# Altium schematic sheet Power_Stage.SchDoc: Power Stage
size A3; Author: M.Beldyga; CompanyName: WUT ISE; DrawnBy: M.Beldyga; Organization: WUT ISE; Address1: PW ISE; Address2: Nowowiejska 15/19 00-665 Warsaw; Address3: micbeldyga@gmail.com; SheetNumber: 6; SheetTotal: 9; ModifiedBy: -; CheckedDate: -; DivGrp: WUT ISE; Designer: GK, MB; ModifiedDate: -; ProjectName: Sensor Box
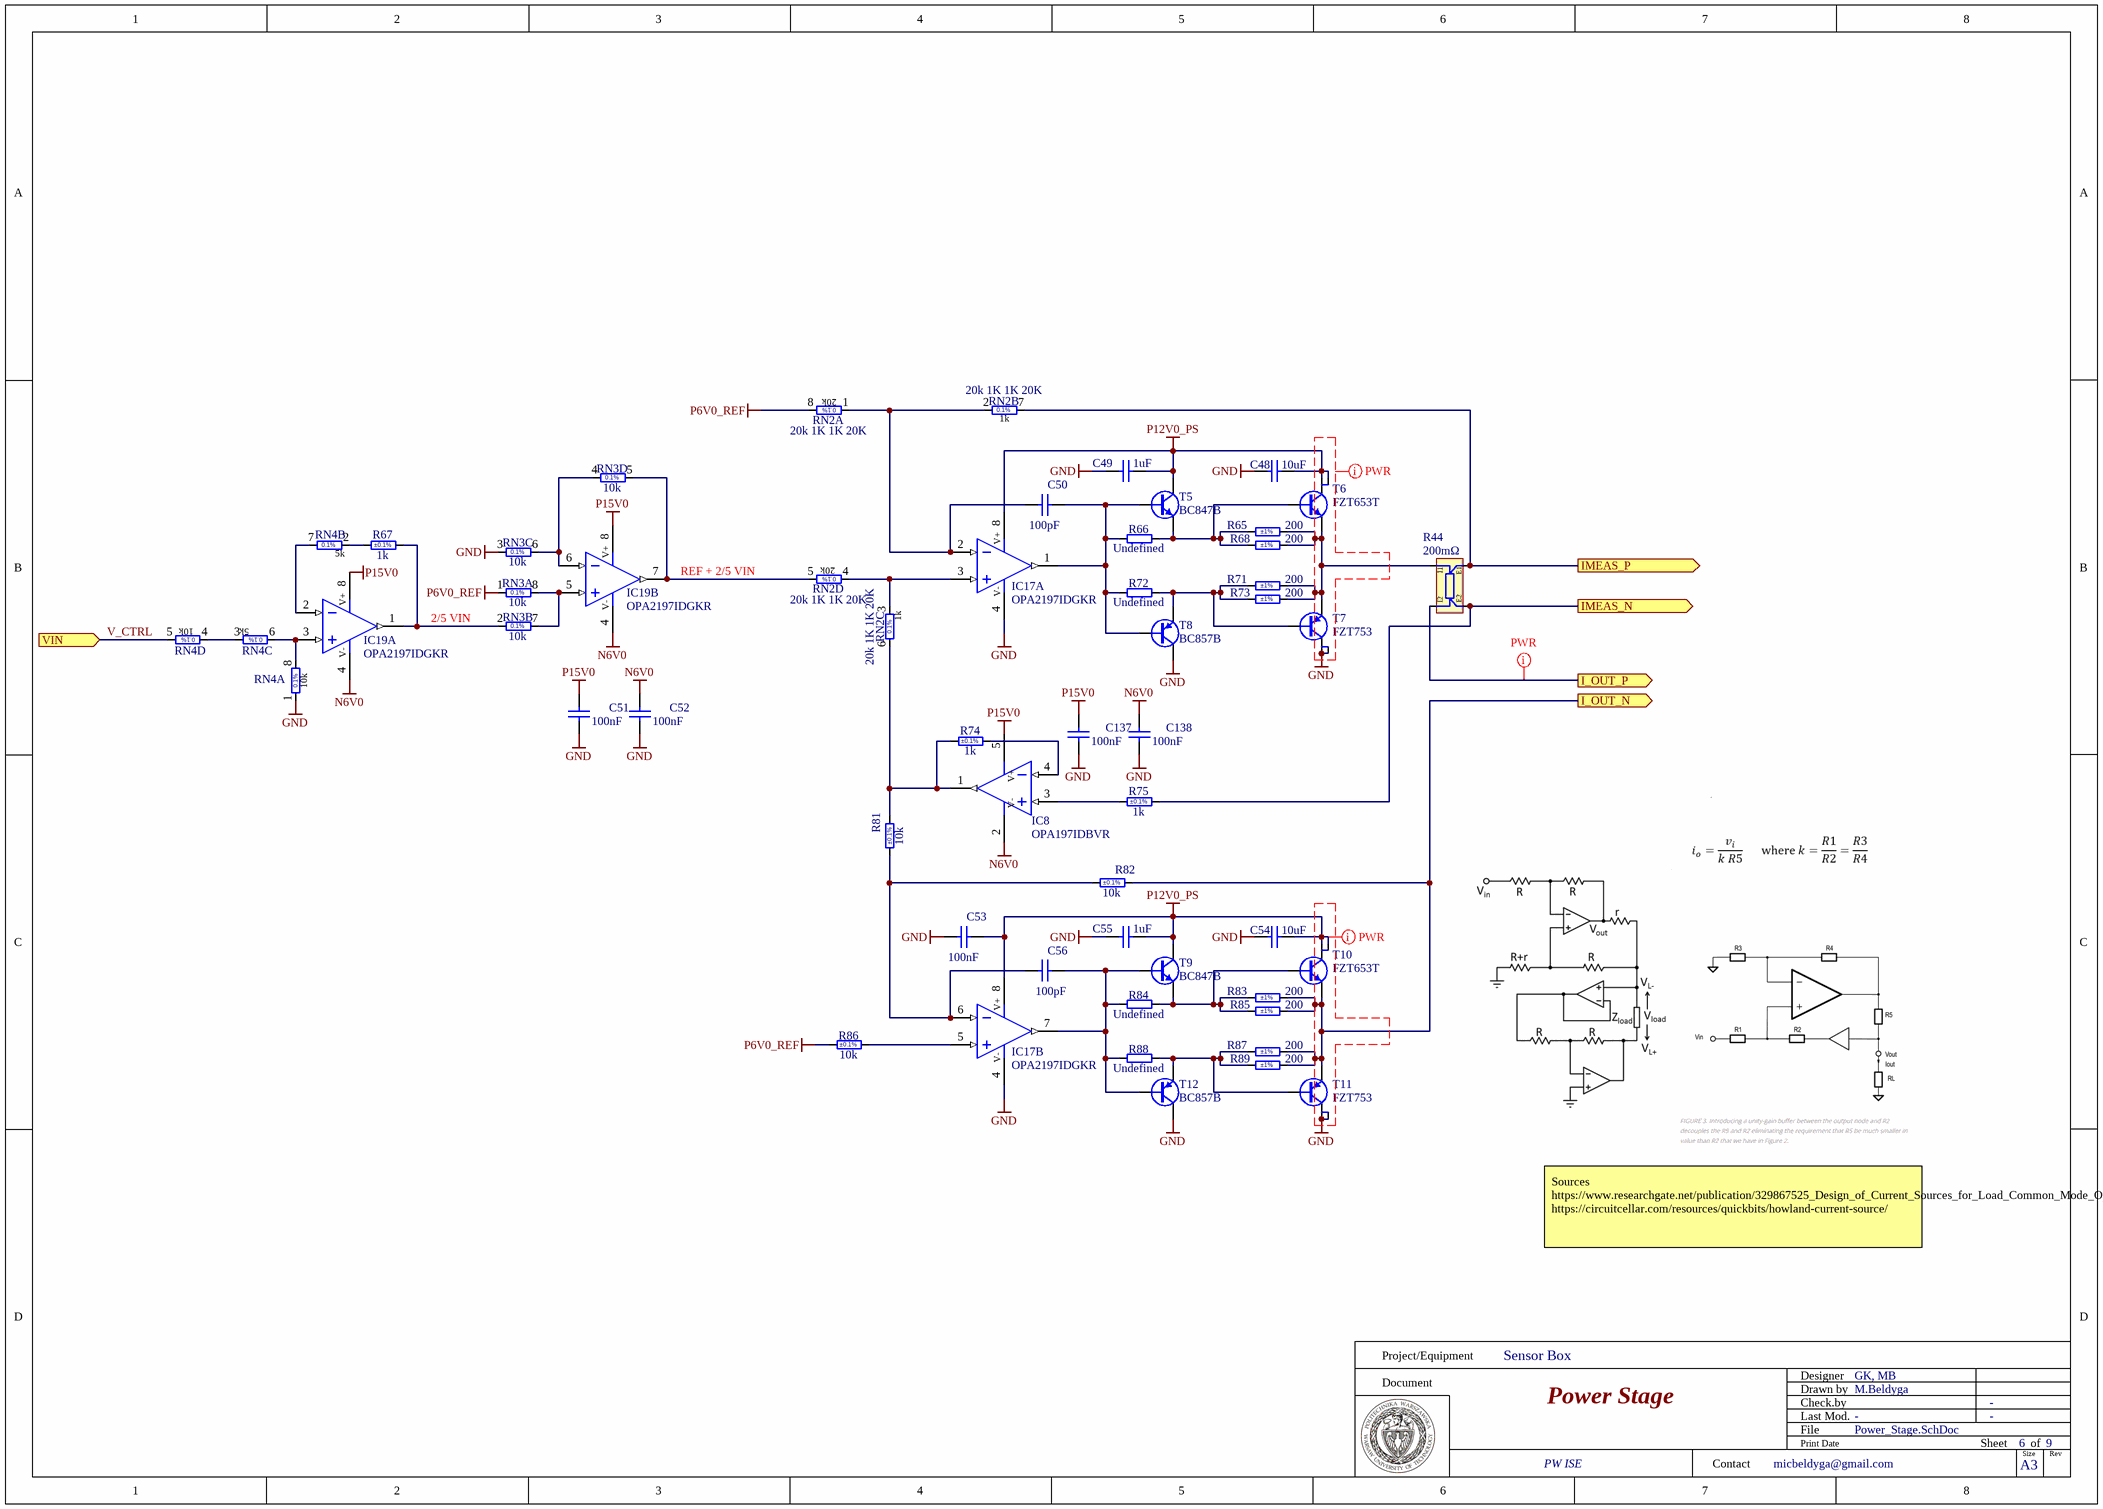
[diagram p0: Power_Stage.SchDoc]

## Parts
C48  10uF  [CAPC2012X95N]
C49  1uF  [CAPC1608X87N]
C50  100pF  [CAPC1005X55N]
C51  100nF  [CAPC1005X55N]
C52  100nF  [CAPC1005X55N]
C53  100nF  [CAPC1005X55N]
C54  10uF  [CAPC2012X95N]
C55  1uF  [CAPC1608X87N]
C56  100pF  [CAPC1005X55N]
C137  100nF  [CAPC1005X55N]
C138  100nF  [CAPC1005X55N]
IC8  OPA197IDBVR  [SOT95P280X145-5N]
IC17  OPA2197IDGKR  [SOP65P490X110-8N]  (parts A,B of 2)
IC19  OPA2197IDGKR  [SOP65P490X110-8N]  (parts A,B of 2)
R44  200mΩ  [RES_VISHAY_CSM2512_0R007-0R2]
R65  200  Tolerance: ±1%  [RESC1608X55N]
R66  Undefined  [RESC1608X55N]
R67  1k  Tolerance: ±0.1%  [RESC1005X40N]
R68  200  Tolerance: ±1%  [RESC1608X55N]
R71  200  Tolerance: ±1%  [RESC1608X55N]
R72  Undefined  [RESC1608X55N]
R73  200  Tolerance: ±1%  [RESC1608X55N]
R74  1k  Tolerance: ±0.1%  [RESC1005X40N]
R75  1k  Tolerance: ±0.1%  [RESC1005X40N]
R81  10k  Tolerance: ±0.1%  [RESC1005X35N]
R82  10k  Tolerance: ±0.1%  [RESC1005X35N]
R83  200  Tolerance: ±1%  [RESC1608X55N]
R84  Undefined  [RESC1608X55N]
R85  200  Tolerance: ±1%  [RESC1608X55N]
R86  10k  Tolerance: ±0.1%  [RESC1005X35N]
R87  200  Tolerance: ±1%  [RESC1608X55N]
R88  Undefined  [RESC1608X55N]
R89  200  Tolerance: ±1%  [RESC1608X55N]
RN2  20k 1K 1K 20K  [SOIC127P600X175-8N]  (parts A,B,C,D of 4)
RN3  10k  [SOIC127P600X175-8N]  (parts A,B,C,D of 4)
RN4  10k 5K 5K 10K  [SOIC127P600X175-8N]  (value not drawn)  (parts A,B,C,D of 4)
T5  BC847B  [SOT95P230X110-3N]
T6  FZT653T  [SOT230P700X180-4N]
T7  FZT753  [SOT230P700X180-4N]
T8  BC857B  [SOT95P230X110-3N]
T9  BC847B  [SOT95P230X110-3N]
T10  FZT653T  [SOT230P700X180-4N]
T11  FZT753  [SOT230P700X180-4N]
T12  BC857B  [SOT95P230X110-3N]

## Ports
I_OUT_N (out), I_OUT_P (out), IMEAS_N (out), IMEAS_P (out), VIN (in)

## Nets
GND: C48.2 C49.1 C51.1 C52.1 C53.1 C54.2 C55.1 C137.1 C138.1 IC17.4(V-) RN3.3 RN4.1 T7.2(C) T7.4(C) T8.3(C) T11.2(C) T11.4(C) T12.3(C)
N6V0: C52.2 C138.2 IC8.2(V-) IC19.4(V-)
P6V0_REF: R86.1 RN2.8 RN3.1
P12V0_PS: C48.1 C49.2 C53.2 C54.1 C55.2 IC17.8(V+) T5.3(C) T6.2(C) T6.4(C) T9.3(C) T10.2(C) T10.4(C)
P15V0: C51.2 C137.2 IC8.5(V+) IC19.8(V+)
I_OUT_N: R82.2 R83.2 R85.2 R87.2 R89.2 T10.3(E) T11.3(E) ; port I_OUT_N
I_OUT_P: R44.I2 ; port I_OUT_P
IMEAS_N: R44.E2 R75.2 ; port IMEAS_N
IMEAS_P: R44.E1 RN2.7 ; port IMEAS_P
V_CTRL: RN4.5 ; port VIN
NetC50_1: C50.1 IC17.2(IN-) RN2.1 RN2.2
NetC50_2: C50.2 IC17.1(OUT) R66.1 R72.1 T5.1(B) T8.1(B)
NetC56_1: C56.1 IC17.6(IN-) R81.1 R82.1
NetC56_2: C56.2 IC17.7(OUT) R84.1 R88.1 T9.1(B) T12.1(B)
NetIC8_1: IC8.1(OUT) R74.1 R81.2 RN2.6
NetIC8_3: IC8.3(IN+) R75.1
NetIC8_4: IC8.4(IN-) R74.2
NetIC17_3: IC17.3(IN+) RN2.3 RN2.4
NetIC17_5: IC17.5(IN+) R86.2
NetIC19_1: IC19.1(OUT) R67.2 RN3.2
NetIC19_2: IC19.2(IN-) RN4.7
NetIC19_3: IC19.3(IN+) RN4.6 RN4.8
NetIC19_5: IC19.5(IN+) RN3.7 RN3.8
NetIC19_6: IC19.6(IN-) RN3.4 RN3.6
NetIC19_7: IC19.7(OUT) RN2.5 RN3.5
NetR44_I1: R44.I1 R65.2 R68.2 R71.2 R73.2 T6.3(E) T7.3(E)
NetR65_1: R65.1 R66.2 R68.1 T5.2(E) T6.1(B)
NetR67_1: R67.1 RN4.2
NetR71_1: R71.1 R72.2 R73.1 T7.1(B) T8.2(E)
NetR83_1: R83.1 R84.2 R85.1 T9.2(E) T10.1(B)
NetR87_1: R87.1 R88.2 R89.1 T11.1(B) T12.2(E)
NetRN4_3: RN4.3 RN4.4

## Layout directives
net class PWR: GND, I_OUT_P, P12V0_PS

## Notes on the sheet
- REF + 2/5 VIN
- (near RN3) 2/5 VIN
- Sources https://www.researchgate.net/publication/329867525_Design_of_Current_Sources_for_Load_Common_Mode_Optimization/figures?lo=1
  https://circuitcellar.com/resources/quickbits/howland-current-source/
- Project/Equipment
- Document
- Designer
- Drawn by
- Check.by
- Contact
- File
- Last Mod.
- Print Date
- Sheet
- Size
- A3
- of
- Rev
- (in symbol RN_10K_5K_VISHAY_AORN2-1AT3, part A) 10k
- (in symbol RN_10K_5K_VISHAY_AORN2-1AT3, part B) 5k
- (in symbol RN_10K_5K_VISHAY_AORN2-1AT3, part C) 5k
- (in symbol RN_10K_5K_VISHAY_AORN2-1AT3, part D) 10k
- (in symbol RN_20K_1K_VISHAY_AORN20-1A, part A) 20k
- (in symbol RN_20K_1K_VISHAY_AORN20-1A, part B) 1k
- (in symbol RN_20K_1K_VISHAY_AORN20-1A, part C) 1k
- (in symbol RN_20K_1K_VISHAY_AORN20-1A, part D) 20k

## Library data of the parts
C48 C54 = CC0805_10UF_25V_10%_X5R: Non-polarised capacitor; Part Description: SMD Multilayer Chip Ceramic Capacitor; Manufacturer: GENERIC; Manufacturer1 Part Number: GRM21BR61E106KA73L; Voltage: 25V; TC: X5R; Tolerance: ±10%; Part Number: CC0805_10UF_25V_10%_X5R; Component Kind: Standard; Component Type: Standard; Pin Count: 2; Value: 10uF; Status: Preferred; Manufacturer Part Number: CC0805_10UF_25V_10%_X5R; Case: 0805; Mounted: Yes; Socket: No; SMD: Yes; Sense: No; Manufacturer1 Example: MURATA; Manufacturer1 ComponentHeight: 0.95mm; HelpURL: \\cern.ch\dfs\Applications\Altium\Datasheets\CC0805_X5R_MURATA_GRM.pdf; Author: CERN DEM JLC; CreateDate: 25.10.2012; LatestRevisionDate: 06.09.2016
C49 C55 = CC0603_1UF_25V_10%_X7R: Non-polarised capacitor; Part Description: SMD Multilayer Chip Ceramic Capacitor; Manufacturer: GENERIC; Manufacturer1 Part Number: GCM188R71E105KA64D; Voltage: 25V; TC: X7R; Tolerance: ±10%; Part Number: CC0603_1UF_25V_10%_X7R; Component Kind: Standard; Component Type: Standard; Pin Count: 2; Value: 1uF; Status: None; Manufacturer Part Number: CC0603_1UF_25V_10%_X7R; Case: 0603; Mounted: Yes; Socket: No; SMD: Yes; Sense: No; Manufacturer1 Example: MURATA; Manufacturer1 ComponentHeight: 0.9mm; HelpURL: \\cern.ch\dfs\Applications\Altium\Datasheets\CC0603_X7R_MURATA.pdf; Author: CERN DEM JLC; CreateDate: 18.01.2011; LatestRevisionDate: 18.01.2011
C50 C56 = CC0402_100PF_50V_5%_C0G: Non-polarised capacitor; Part Description: SMD Multilayer Chip Ceramic Capacitor; Manufacturer: GENERIC; Manufacturer1 Part Number: C0402C101J5GACTU; Voltage: 50V; TC: C0G/NP0; Tolerance: ±5%; Part Number: CC0402_100PF_50V_5%_C0G; Component Kind: Standard; Component Type: Standard; Pin Count: 2; Value: 100pF; Status: Preferred; Manufacturer Part Number: CC0402_100PF_50V_5%_C0G; Case: 0402; Mounted: Yes; Socket: No; SMD: Yes; Sense: No; Manufacturer1 Example: KEMET; Manufacturer1 ComponentHeight: 0.55mm; HelpURL: \\cern.ch\dfs\Applications\Altium\Datasheets\CC0402_C0G_KEMET_(Commercial Grade).pdf; Author: CERN DEM JLC; CreateDate: 12/3/2007; LatestRevisionDate: 4/22/2015
C51-C53 C137 C138 = CC0402_100NF_16V_10%_X5R: Non-polarised capacitor; Part Description: SMD Multilayer Chip Ceramic Capacitor; Manufacturer: GENERIC; Manufacturer1 Part Number: GRM155R61C104KA88D; Voltage: 16V; TC: X5R; Tolerance: ±10%; Part Number: CC0402_100NF_16V_10%_X5R; Component Kind: Standard; Component Type: Standard; Pin Count: 2; Value: 100nF; Status: None; Manufacturer Part Number: CC0402_100NF_16V_10%_X5R; Case: 0402; Mounted: Yes; Socket: No; SMD: Yes; Sense: No; Manufacturer1 Example: MURATA; Manufacturer1 ComponentHeight: 0.55mm; HelpURL: \\cern.ch\dfs\Applications\Altium\Datasheets\CC0402_X5R_MURATA_GRM.pdf; Author: CERN DEM JLC; CreateDate: 10.12.2013; LatestRevisionDate: 10.12.2013
IC8 = OPA197IDBVR: Op Amp Single Precision Amplifier R-R I/O ±18V/36V 5-Pin SOT-23 T/R; Manufacturer: Texas Instruments; Manufacturer Lifecycle Status: ACTIVE; Gain Bandwidth Product: 10MHz; Input Bias Current: 5pA; Input Offset Voltage (Vos): 25µV; Number of Channels: 1; Operating Supply Current: 1mA; Output Current per Channel: 65mA; Slew Rate: 20V/µs; Supplier: DigiKey; Supplier Part Number: 296-47813-6-ND; Manufacturer Part Number: OPA197IDBVR; RoHS: Compliant; Category: Amplifiers - Op Amps, Buffer, Instrumentation; Pricing: 1=1.71, 10=1.254, 25=1.1404, 100=1.0149, 250=0.95512, 500=0.9191, 1000=0.88942 (USD); Case/Package: SOT-23; Height: 1.45mm; Lead Free: Lead Free; Length: 2.9mm; Lifecycle Status: Production; Max Operating Temperature: 125°C; Min Operating Temperature: -40°C; Mounting Technology: Surface Mount; Number of Circuits: 1; Pins: 5; Schedule B: 8542330000, 8542330000|8542330000|8542330000|8542330000|8542330000|8542330000|8542330000|8542330000|8542330000|8542330000|8542330000|8542330000|8542330000|8542330000|8542330000|8542330000|8542330000|8542330000|8542330000|8542330000|8542330000|8542330000|8542330000|85; Thickness: 1.2mm; Width: 1.6mm; ComponentLink1URL: https://sigma.octopart.com:443/177332311/technical_drawing/Texas-Instruments-OPA197IDBVR.pdf?src-supplier=Texas+Instruments; ComponentLink1Description: https://sigma.octopart.com:443/177332311/technical_drawing/Texas-Instruments-OPA197IDBVR.pdf?src-supplier=Texas+Instruments; ComponentLink2URL: https://octopart.com:443/opatz8j6/c1?t=Q1P8Bdc4KgCCbFqp7UlYpcJ8AhpVpiPIEDSj71pxBcZVcsUhmuEmpKuLfuswML2SqYTIjZ0KbZTePt0BTa5L0Ib-QO4qx2Pc4AGXPK19iWgmTvAzROBybWvsv8SVdmbKXcfVjzYF5gNG51bfmeDdyG8TPrSMEhnU0XxyolWqRvFZRm1lt3I32W7t_wfMxmeR34edfRjLHyyRFXxPyflRs4eg4WP07F8bmt6pOKmN-USMuy6Faze7x22RpNONDH4EojWIvEjwq6_wS8mD7vZGVP7z7Ngk7vArTcyRg02zIl199DZ1b6QvO1RGY5iVnJ8IHDniUbpBX1tObbv_cSSRQlS6KVLtLLjRXr4EmXhu9GKtw9wXk68tfrl34suuqK6ened5hg&src-supplier=Texas+Instruments; ComponentLink2Description: https://octopart.com:443/opatz8j6/c1?t=Q1P8Bdc4KgCCbFqp7UlYpcJ8AhpVpiPIEDSj71pxBcZVcsUhmuEmpKuLfuswML2SqYTIjZ0KbZTePt0BTa5L0Ib-QO4qx2Pc4AGXPK19iWgmTvAzROBybWvsv8SVdmbKXcfVjzYF5gNG51bfmeDdyG8TPrSMEhnU0XxyolWqRvFZRm1lt3I32W7t_wfMxmeR34edfRjLHyyRFXxPyflRs4eg4WP07F8bmt6pOKmN-USMuy6Faze7x22RpNONDH4EojWIvEjwq6_wS8mD7vZGVP7z7Ngk7vArTcyRg02zIl199DZ1b6QvO1RGY5iVnJ8IHDniUbpBX1tObbv_cSSRQlS6KVLtLLjRXr4EmXhu9GKtw9wXk68tfrl34suuqK6ened5hg&src-supplier=Texas+Instruments; ComponentLink3URL: https://sigma.octopart.com:443/175570406/technical_drawing/Texas-Instruments-OPA197IDBVR.pdf?src-supplier=Texas+Instruments; ComponentLink3Description: https://sigma.octopart.com:443/175570406/technical_drawing/Texas-Instruments-OPA197IDBVR.pdf?src-supplier=Texas+Instruments; ComponentLink4URL: https://sigma.octopart.com:443/169406034/technical_drawing/Texas-Instruments-OPA197IDBVR.pdf?src-supplier=Texas+Instruments; ComponentLink4Description: https://sigma.octopart.com:443/169406034/technical_drawing/Texas-Instruments-OPA197IDBVR.pdf?src-supplier=Texas+Instruments; ComponentLink5URL: https://sigma.octopart.com:443/155939316/technical_drawing/Texas-Instruments-OPA197IDBVR.pdf?src-supplier=Texas+Instruments; ComponentLink5Description: https://sigma.octopart.com:443/155939316/technical_drawing/Texas-Instruments-OPA197IDBVR.pdf?src-supplier=Texas+Instruments; ComponentLink6URL: https://sigma.octopart.com:443/102331370/technical_drawing/Texas-Instruments-OPA197IDBVR.pdf?src-supplier=Texas+Instruments; ComponentLink6Description: https://sigma.octopart.com:443/102331370/technical_drawing/Texas-Instruments-OPA197IDBVR.pdf?src-supplier=Texas+Instruments; ComponentLink7URL: https://datasheet.octopart.com:443/OPA197IDBVR-Texas-Instruments-datasheet-62062805.pdf?src-supplier=Texas+Instruments; ComponentLink7Description: https://datasheet.octopart.com:443/OPA197IDBVR-Texas-Instruments-datasheet-62062805.pdf?src-supplier=Texas+Instruments; ComponentLink8URL: https://sigma.octopart.com:443/49249325/technical_drawing/Texas-Instruments-OPA197IDBVR.pdf?src-supplier=Texas+Instruments; ComponentLink8Description: https://sigma.octopart.com:443/49249325/technical_drawing/Texas-Instruments-OPA197IDBVR.pdf?src-supplier=Texas+Instruments; ComponentLink9URL: https://datasheet.octopart.com:443/OPA197IDBVR-Texas-Instruments-datasheet-164361763.pdf?src-supplier=SHENGYU+ELECTRONICS; ComponentLink9Description: https://datasheet.octopart.com:443/OPA197IDBVR-Texas-Instruments-datasheet-164361763.pdf?src-supplier=SHENGYU+ELECTRONICS; ComponentLink10URL: https://datasheet.octopart.com:443/OPA197IDBVR-Texas-Instruments-datasheet-165804228.pdf?src-supplier=LCSC; ComponentLink10Description: https://datasheet.octopart.com:443/OPA197IDBVR-Texas-Instruments-datasheet-165804228.pdf?src-supplier=LCSC; ComponentLink11URL: https://datasheet.octopart.com:443/OPA197IDBVR-Texas-Instruments-datasheet-159115560.pdf?src-supplier=LCSC; ComponentLink11Description: https://datasheet.octopart.com:443/OPA197IDBVR-Texas-Instruments-datasheet-159115560.pdf?src-supplier=LCSC; ComponentLink12URL: https://datasheet.octopart.com:443/OPA197IDBVR-Texas-Instruments-datasheet-140571582.pdf?src-supplier=Arrow.cn; ComponentLink12Description: https://datasheet.octopart.com:443/OPA197IDBVR-Texas-Instruments-datasheet-140571582.pdf?src-supplier=Arrow.cn; ComponentLink13URL: https://datasheet.octopart.com:443/OPA197IDBVR-Texas-Instruments-datasheet-137316104.pdf?src-supplier=Future+Electronics; ComponentLink13Description: https://datasheet.octopart.com:443/OPA197IDBVR-Texas-Instruments-datasheet-137316104.pdf?src-supplier=Future+Electronics; ComponentLink14URL: http://sigma.octopart.com:80/reach_statement/Texas-Instruments-company-64.pdf?src-supplier=Compliance+Statements; ComponentLink14Description: http://sigma.octopart.com:80/reach_statement/Texas-Instruments-company-64.pdf?src-supplier=Compliance+Statements; ComponentLink15URL: http://sigma.octopart.com:80/conflict_mineral_statement/Texas-Instruments-company-63.pdf?src-supplier=Compliance+Statements; ComponentLink15Description: http://sigma.octopart.com:80/conflict_mineral_statement/Texas-Instruments-company-63.pdf?src-supplier=Compliance+Statements
IC17 IC19 = OA_OPA2197IDGKR: 36-V, Precision, Rail-to-Rail Input Output, Low Offset Voltage Op Amp 8-VSSOP; Part Description: High-Precision, Low-Noise, Rail-to-Rail Output,10-MHz Op Amp; Manufacturer1: TEXAS INSTRUMENTS; PressFit: No; Bonding: No; Part Number: OPA2197IDGKR; Component Kind: Standard; Component Type: Standard; Device: OPA2197IDGKR; PackageDescription: SOP, 0.65mm pitch; 8 pin, 3.00mm W X 3.00mm L X 1.10mm H body, IPC Medium Density; Manufacturer1 Part Number: OPA2197IDGKR; Pin Count: 8; Case: MSOP8; Mounted: Yes; Socket: No; SMD: Yes; Sense: No; ComponentHeight: 1.1mm; Author: GK; HelpURL: \\cern.ch\dfs\Applications\Altium\Datasheets\OPA2140AIDGK.pdf; CreateDate: 20.04.2017; LatestRevisionDate: 20.04.2017
R44 = Y14870R20000B9R: Fixed Resistor, Metal Strip, 1W, 0.2ohm, 0.447V, 0.1% +/-Tol, 15ppm/Cel, Surface Mount, 2512; Manufacturer: VPG Foil Resistors; Temperature Coefficient: 15ppm/°C; Working Voltage: 447mV; Supplier: DigiKey; Supplier Part Number: 804-Y14870R20000B9RCT-ND; Manufacturer Part Number: Y14870R20000B9R; RoHS: Compliant; Category: Chip SMD Resistors; Stock: 1352; Pricing: 1=12.8, 10=8.918, 25=7.8692, 50=7.2126, 100=6.6548, 250=6.25768 (USD); Case/Package: 2512; Case Code (Imperial): 2512; Case Code (Metric): 6432; Composition: Metal Foil; Features: Moisture Resistant; Height: 635µm; Length: 6.35mm; Lifecycle Status: Production; Max Operating Temperature: 170°C; Max Power Dissipation: 1W; Min Operating Temperature: -65°C; Mounting Technology: Surface Mount; Number of Terminals: 2; Number of Terminations: 4; Packaging: Tape & Reel (TR); Power Dissipation: 1W; REACH SVHC: Yes; Value: 200mΩ; Tolerance: 0.1%; Width: 3.175mm; ComponentLink1URL: https://datasheet.octopart.com:443/Y14870R20000B9R-Vishay-Precision-Group-datasheet-182188787.pdf?src-supplier=IHS; ComponentLink1Description: https://datasheet.octopart.com:443/Y14870R20000B9R-Vishay-Precision-Group-datasheet-182188787.pdf?src-supplier=IHS; ComponentLink2URL: https://datasheet.octopart.com:443/Y14870R20000B9R-VPG-Foil-Resistors-datasheet-182027518.pdf?src-supplier=IHS; ComponentLink2Description: https://datasheet.octopart.com:443/Y14870R20000B9R-VPG-Foil-Resistors-datasheet-182027518.pdf?src-supplier=IHS
R65 R68 R71 R73 R83 R85 R87 R89 = R0603_200R_1%_0.1W_100PPM: Resistor - 1%; Part Description: General Purpose Thick Film Chip Resistor; Manufacturer: GENERIC; Manufacturer1: Vishay; Manufacturer1 Part Number: CRCW0603200RFKEA; Power: 0.1W; TC: ±100ppm/°C; PressFit: No; Part Number: R0603_200R_1%_0.1W_100PPM; Component Kind: Standard; Component Type: Standard; Pin Count: 2; Value: 200; Status: Preferred; Manufacturer Part Number: R0603_200R_1%_0.1W_100PPM; Case: 0603; Mounted: Yes; Sense: No; Socket: No; SMD: Yes; Manufacturer1 ComponentHeight: 0.55mm; HelpURL: \\cern.ch\dfs\Applications\Altium\Datasheets\R0603_NIC_NRC.pdf; Author: CERN DEM JLC; CreateDate: 03.12.2007; LatestRevisionDate: 13.03.2008
R66 R72 R84 R88 = R0603_NO-VALUE: Resistor; Part Description: Reserved Footprint For a 0603 (1608) Chip Resistor; PressFit: No; Mounted: No; Part Number: R0603_NO-VALUE; Component Kind: Standard; Component Type: Standard; Pin Count: 2; Value: Undefined; Status: None; Manufacturer: Undefined; Manufacturer Part Number: R0603_NO-VALUE; Case: 0603; Sense: No; Socket: No; SMD: Yes; Manufacturer1 Example: Undefined; Manufacturer1 Part Number: Undefined; Manufacturer1 ComponentHeight: Undefined; HelpURL: Undefined; Author: CERN DEM JLC; CreateDate: 03.12.2007; LatestRevisionDate: 13.03.2008
R67 R74 R75 = R0402_1K_0.1%_0.063W_25PPM: Resistor - 0.1%; Part Description: Thin Film Precision Resistor; Manufacturer: GENERIC; Manufacturer1 Part Number: ERA2AEB102X; Power: 0.063W; TC: ±25ppm/°C; PressFit: No; Voltage: 50V; Part Number: R0402_1K_0.1%_0.063W_25PPM; Component Kind: Standard; Component Type: Standard; Pin Count: 2; Value: 1k; Status: Not Recommended; Manufacturer Part Number: R0402_1K_0.1%_0.063W_25PPM; Case: 0402; Mounted: Yes; Sense: No; Socket: No; SMD: Yes; Manufacturer1 ComponentHeight: 0.4mm; HelpURL: \\cern.ch\dfs\Applications\Altium\Datasheets\R0402_PANASONIC_ERA.pdf; Author: CERN DEM BC; CreateDate: 7/10/2020; LatestRevisionDate: 7/10/2020; Manufacturer1 Example: PANASONIC
R81 R82 R86 = R0402_10K_0.1%_0.063W_25PPM: Resistor - 0.1%; Part Description: Thin Film Precision Resistor; Manufacturer: GENERIC; Manufacturer1 Part Number: CPF0402B10KE1; Power: 0.063W; TC: ±25ppm/°C; PressFit: No; Part Number: R0402_10K_0.1%_0.063W_25PPM; Component Kind: Standard; Component Type: Standard; Pin Count: 2; Value: 10k; Status: Not Recommended; Manufacturer Part Number: R0402_10K_0.1%_0.063W_25PPM; Case: 0402; Mounted: Yes; Sense: No; Socket: No; SMD: Yes; Manufacturer1 ComponentHeight: 0.35mm; HelpURL: \\cern.ch\dfs\Applications\Altium\Datasheets\R0402_TYCO_CPF.pdf; Author: CERN DEM JMW; CreateDate: 9/22/2015; LatestRevisionDate: 9/22/2015; Manufacturer1 Example: TE CONNECTIVITY
RN2 = RN_20K_1K_VISHAY_AORN20-1A: DIL8 Resistor Network 4 Resistors 4xR 10k-1k-1k-10k 0.1%; Part Number: RN_20K_1K_VISHAY_AORN10-1A; Part Description: Dual-In-Line Thin Film Precision Automotive Resistors Network, (4 Isolated) - AORN Series; Manufacturer1: VISHAY DALE; Manufacturer1 Part Number: AORN20-1AT5; Power: 4x0.1W; TC: ±25ppm/°C; PressFit: No; Component Kind: Standard; Component Type: Standard; Pin Count: 8; Value: 20k 1K 1K 20K; Sense: No; Tolerance: 0.1%; Case: SOIC8; Mounted: Yes; Socket: No; SMD: Yes; ComponentHeight: 1.73mm; HelpURL: \\cern.ch\dfs\Applications\Altium\Datasheets\RN_VISHAY_AORN.pdf; Author: GK; CreateDate: 20.02.2017; LatestRevisionDate: 15.01.2020
RN3 = RN_10K_VISHAY_AORN1002A: DIL8 Resistor Network 4 Isolated Resistor 0.1%; Part Description: Dual-In-Line Thin Film Precision Automotive Resistors Network, (4 Isolated) - AORN Series; Manufacturer1: VISHAY DALE; Manufacturer1 Part Number: AORN1002AT5; Power: 4x0.1W; TC: ±25ppm/°C; PressFit: No; Part Number: RN_10K_VISHAY_AORN1002A; Component Kind: Standard; Component Type: Standard; Pin Count: 8; Value: 10k; Sense: No; Tolerance: 0.1%; Case: SOIC8; Mounted: Yes; Socket: No; SMD: Yes; ComponentHeight: 1.73mm; HelpURL: \\cern.ch\dfs\Applications\Altium\Datasheets\RN_VISHAY_AORN.pdf; Author: CERN DEM JLC; CreateDate: 20.02.2017; LatestRevisionDate: 03.05.2017
RN4 = RN_10K_5K_VISHAY_AORN2-1AT3: DIL8 Resistor Network 4 Resistors 10k-5k-5k-10k 0.1%; Part Description: Dual-In-Line Thin Film Precision Automotive Resistors Network, (4 Isolated) - AORN Series; Manufacturer1: VISHAY DALE; Manufacturer1 Part Number: AORN2-1AT5; Power: 4x0.1W; TC: ±25ppm/°C; PressFit: No; Part Number: RN_10K_5K_VISHAY_AORN2-1AT3; Component Kind: Standard; Component Type: Standard; Pin Count: 8; Value: 10k 5K 5K 10K; Sense: No; Tolerance: 0.1%; Case: SOIC8; Mounted: Yes; Socket: No; SMD: Yes; ComponentHeight: 1.73mm; HelpURL: \\cern.ch\dfs\Applications\Altium\Datasheets\RN_VISHAY_AORN.pdf; Author: CERN DEM JLC; CreateDate: 20.02.2017; LatestRevisionDate: 20.02.2017
T5 T9 = BC847B: NPN Transistor; Part Description: 45V 100mA NPN General-Purpose Transistor; Manufacturer: NXP SEMICONDUCTORS; PressFit: No; Bonding: No; Part Number: BC847B; Component Kind: Standard; Component Type: Standard; Device: BC847B; PackageDescription: SOT23, 0.95mm Pitch; 3 Pin, 1.30mm W X 2.90mm L X 1.10mm H body, IPC Medium Density; Manufacturer Part Number: BC847B; Pin Count: 3; Case: SOT23-3; Mounted: Yes; Socket: No; SMD: Yes; Sense: No; ComponentHeight: 1.1mm; HelpURL: \\cern.ch\dfs\Applications\Altium\Datasheets\BC847B.pdf; Author: CERN DEM JLC; CreateDate: 6/14/2011; LatestRevisionDate: 6/14/2011
T6 T10 = FZT653T: NPN Transistor; Part Description: 60 To 100V, 2A, NPN Silicon Planar Medium Power High gain Transistor; Manufacturer: ZETEX SEMICONDUCTORS; PressFit: No; Bonding: No; Part Number: FZT653T; Component Kind: Standard; Component Type: Standard; Device: FZT653T; PackageDescription: SOT223, 2.30mm Pitch; 4 Pin, 3.70mm W X 6.70mm L X 1.80mm H body, IPC Medium Density; Manufacturer Part Number: FZT653T; Pin Count: 4; Case: SOT223; Mounted: Yes; Socket: No; SMD: Yes; Sense: No; ComponentHeight: 1.8mm; HelpURL: \\cern.ch\dfs\Applications\Altium\Datasheets\FZT653T.pdf; Author: CERN DEM HF; CreateDate: 4/22/2022; LatestRevisionDate: 4/22/2022
T7 T11 = FZT753: PNP Transistor; Part Description: 60V, 5A, PNP Silicon Planar High Current Transistor; Manufacturer: DIODES INCORPORATED; PressFit: No; Bonding: No; Part Number: FZT753; Component Kind: Standard; Component Type: Standard; Device: FZT753; PackageDescription: SOT223, 2.30mm Pitch; 4 Pin, 3.70mm W X 6.70mm L X 1.80mm H body, IPC Medium Density; Manufacturer Part Number: FZT753; Pin Count: 4; Case: SOT223; Mounted: Yes; Socket: No; SMD: Yes; Sense: No; ComponentHeight: 1.8mm; HelpURL: \\cern.ch\dfs\Applications\Altium\Datasheets\FZT753.pdf; Author: CERN DEM JLC; CreateDate: 8/19/2014; LatestRevisionDate: 8/19/2014
T8 T12 = BC857B: PNP Transistor; Part Description: -45V -100mA PNP General-Purpose Transistors; Manufacturer: NXP SEMICONDUCTORS; PressFit: No; Bonding: No; Part Number: BC857B; Component Kind: Standard; Component Type: Standard; Device: BC857B; PackageDescription: SOT23, 0.95mm Pitch; 3 Pin, 1.30mm W X 2.90mm L X 1.10mm H body, IPC Medium Density; Manufacturer Part Number: BC857B; Pin Count: 3; Case: SOT23-3; Mounted: Yes; Socket: No; SMD: Yes; Sense: No; ComponentHeight: 1.1mm; HelpURL: \\cern.ch\dfs\Applications\Altium\Datasheets\BC857B.pdf; Author: CERN DEM JLC; CreateDate: 6/14/2011; LatestRevisionDate: 6/14/2011